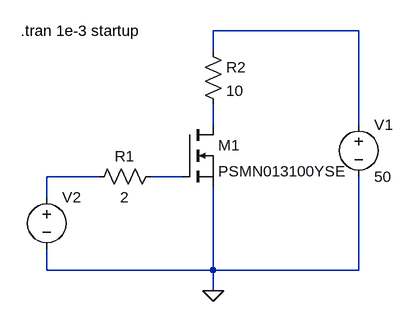
[diagram p0: schematic loadswitch.asc]
loadswitch.asc, the LTspice schematic file:
Version 4
SHEET 1 880 680
WIRE 544 32 320 32
WIRE 320 64 320 32
WIRE 320 176 320 144
WIRE 544 176 544 32
WIRE 144 256 64 256
WIRE 272 256 224 256
WIRE 64 288 64 256
WIRE 64 400 64 368
WIRE 320 400 320 272
WIRE 320 400 64 400
WIRE 544 400 544 256
WIRE 544 400 320 400
WIRE 320 432 320 400
FLAG 320 432 0
SYMBOL res 240 240 R90
WINDOW 0 0 56 VBottom 2
WINDOW 3 32 56 VTop 2
SYMATTR InstName R1
SYMATTR Value 2
SYMBOL res 304 48 R0
SYMATTR InstName R2
SYMATTR Value 10
SYMBOL voltage 544 160 R0
WINDOW 123 0 0 Left 0
WINDOW 39 0 0 Left 0
SYMATTR InstName V1
SYMATTR Value 50
SYMBOL voltage 64 272 R0
WINDOW 3 24 96 Invisible 2
WINDOW 123 0 0 Left 0
WINDOW 39 0 0 Left 0
SYMATTR Value PULSE(0 12 0 1e-9 1e-9 100e-6 200e-6)
SYMATTR InstName V2
SYMBOL nmos 272 176 R0
SYMATTR InstName M1
SYMATTR Value PSMN013100YSE
TEXT 24 32 Left 2 !.tran 1e-3 startup

The netlist it stands for:
* loadswitch.asc
R1 N004 N003 2
R2 N001 N002 10
V1 N001 0 50
V2 N003 0 PULSE(0 12 0 1e-9 1e-9 100e-6 200e-6)
M1 N002 N004 0 0 PSMN013100YSE
.model NMOS NMOS
.model PMOS PMOS
.lib standard.mos
.tran 1e-3 startup
.backanno
.end